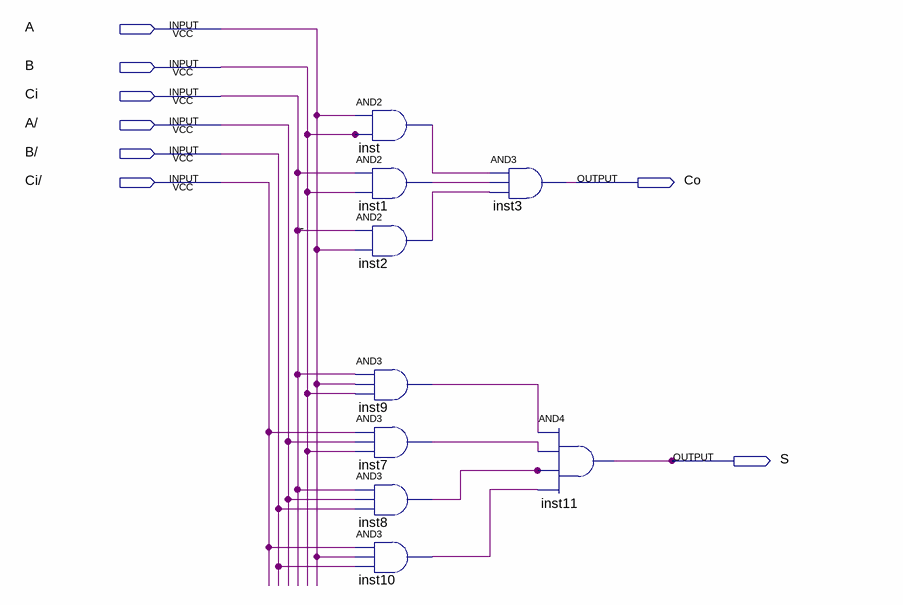
[diagram p0: schematic sheet]
// Quartus schematic fulladder_1b.bdf as structural Verilog: 9 symbols, 8 pins
module fulladder_1b (
  input  A,
  input  B,
  input  Ci,
  input  \A/ ,
  input  \B/ ,
  input  \Ci/ ,
  output Co,
  output S
);

  wire inst1_out, inst2_out, inst7_out, inst8_out, inst9_out, inst10_out, inst_out;

  and inst (inst_out, A, B);
  and inst1 (inst1_out, Ci, B);
  and inst2 (inst2_out, Ci, A);
  and inst9 (inst9_out, Ci, A, B);
  and inst7 (inst7_out, \Ci/ , \A/ , B);
  and inst8 (inst8_out, Ci, \A/ , \B/ );
  and inst10 (inst10_out, \Ci/ , A, \B/ );
  and inst3 (Co, inst_out, inst1_out, inst2_out);
  and inst11 (S, inst9_out, inst7_out, inst8_out, inst10_out);

  // Other names for the same wires on the sheet: ' = A
endmodule
